# EasyEDA Pro project RCkid.epro, board Cartridge V1
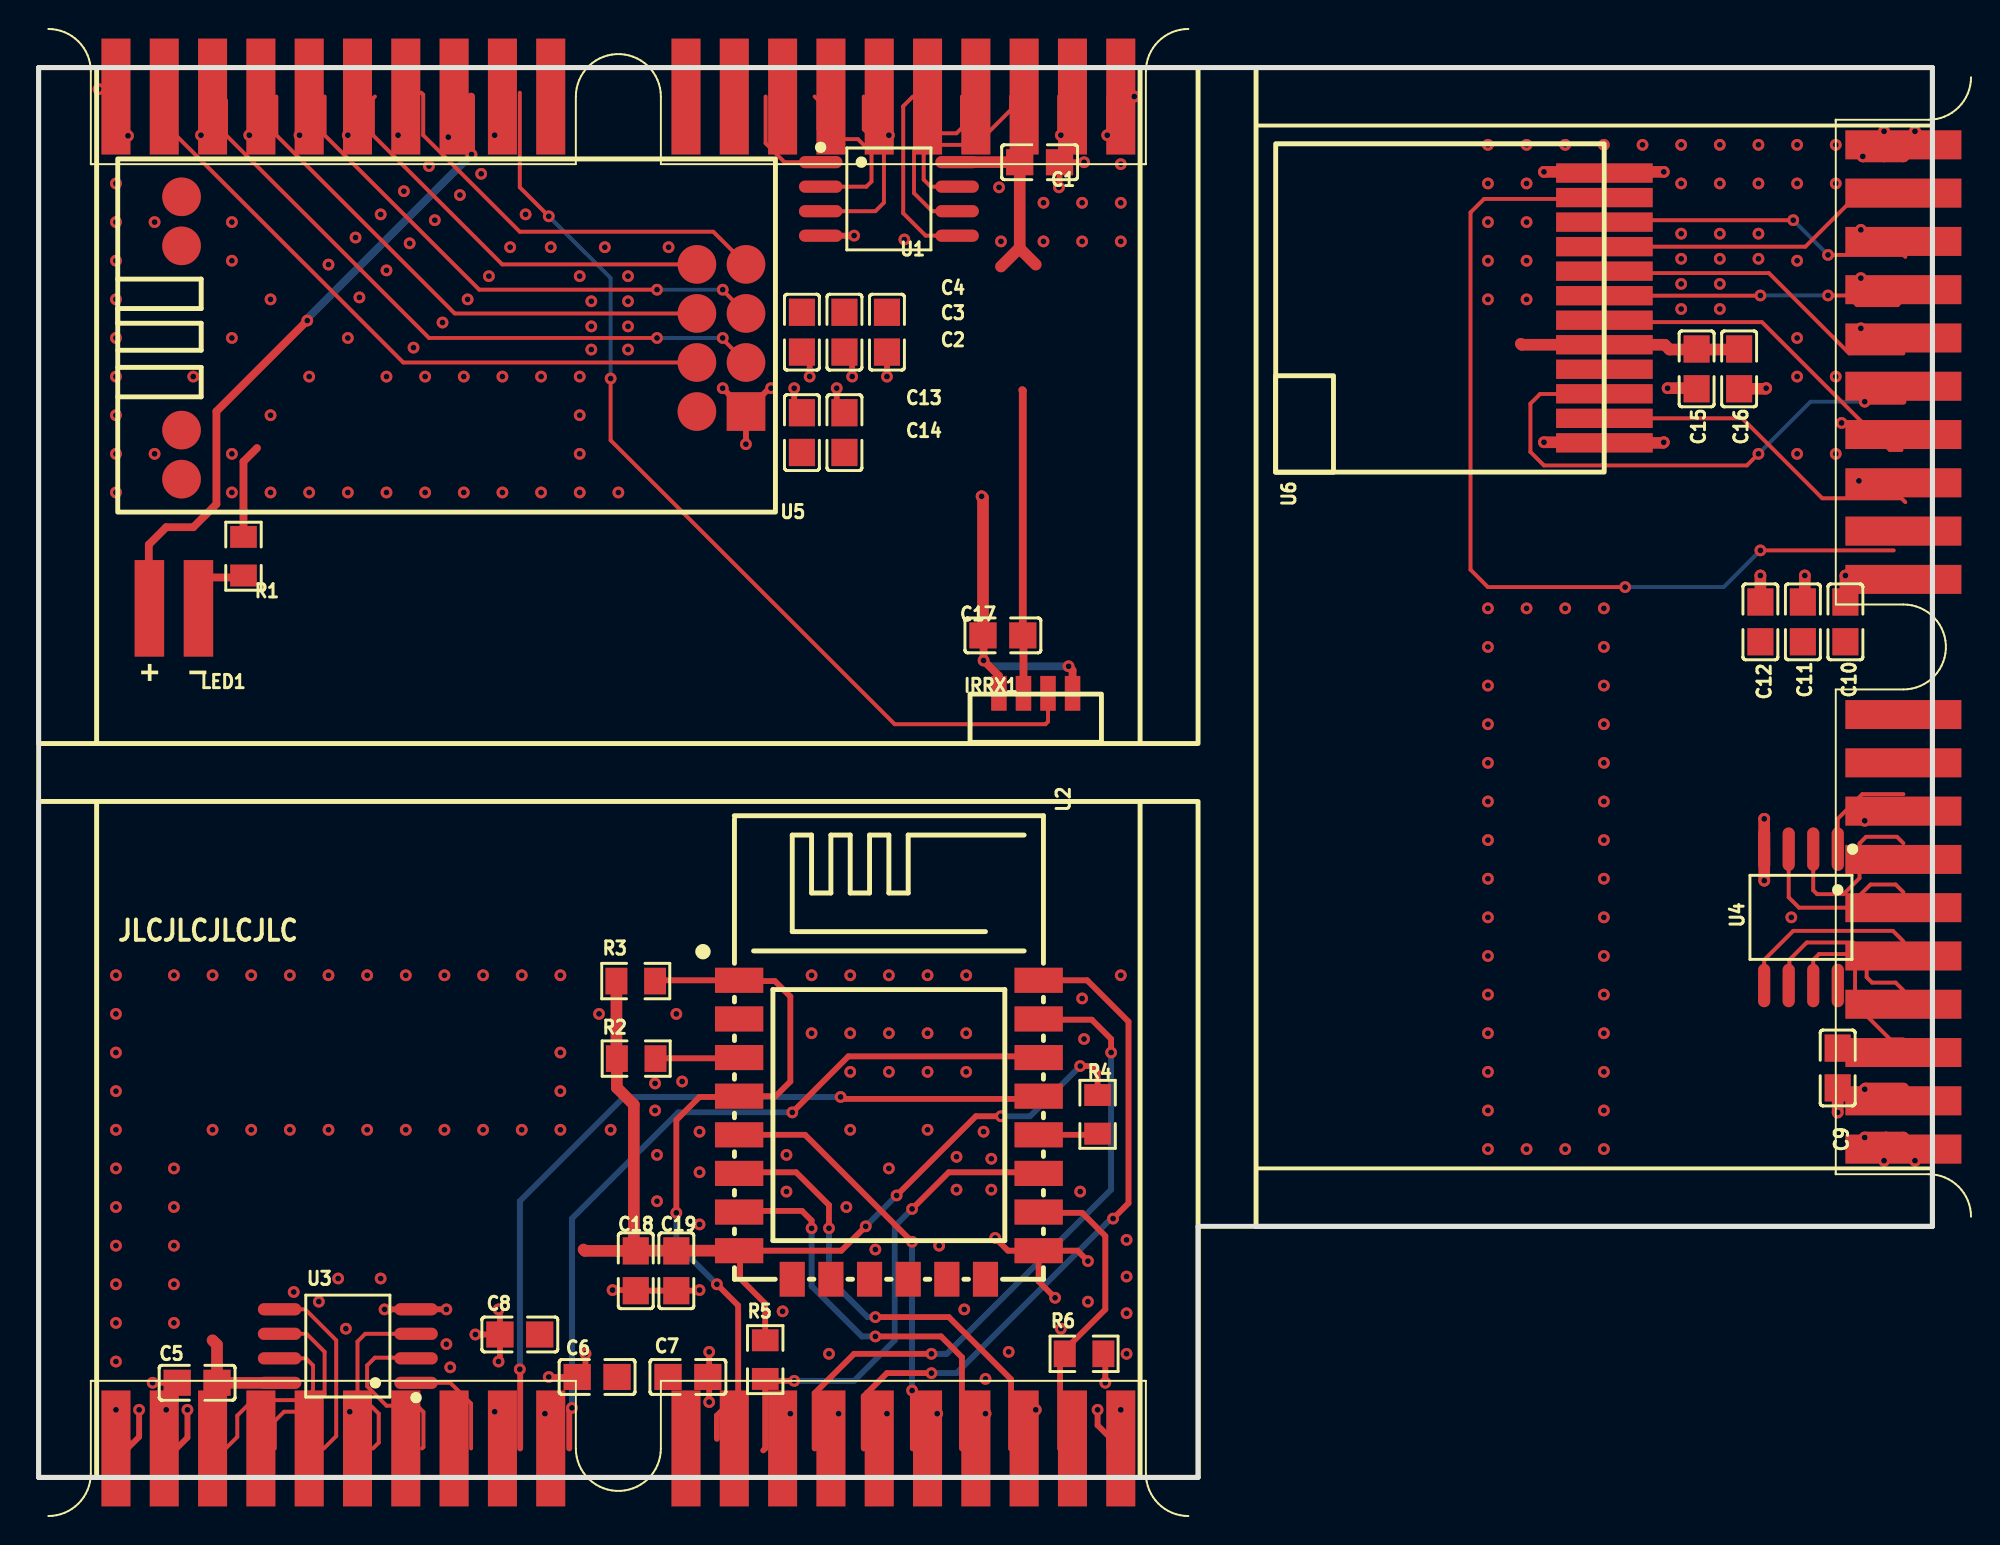
[diagram p22: board, top side]
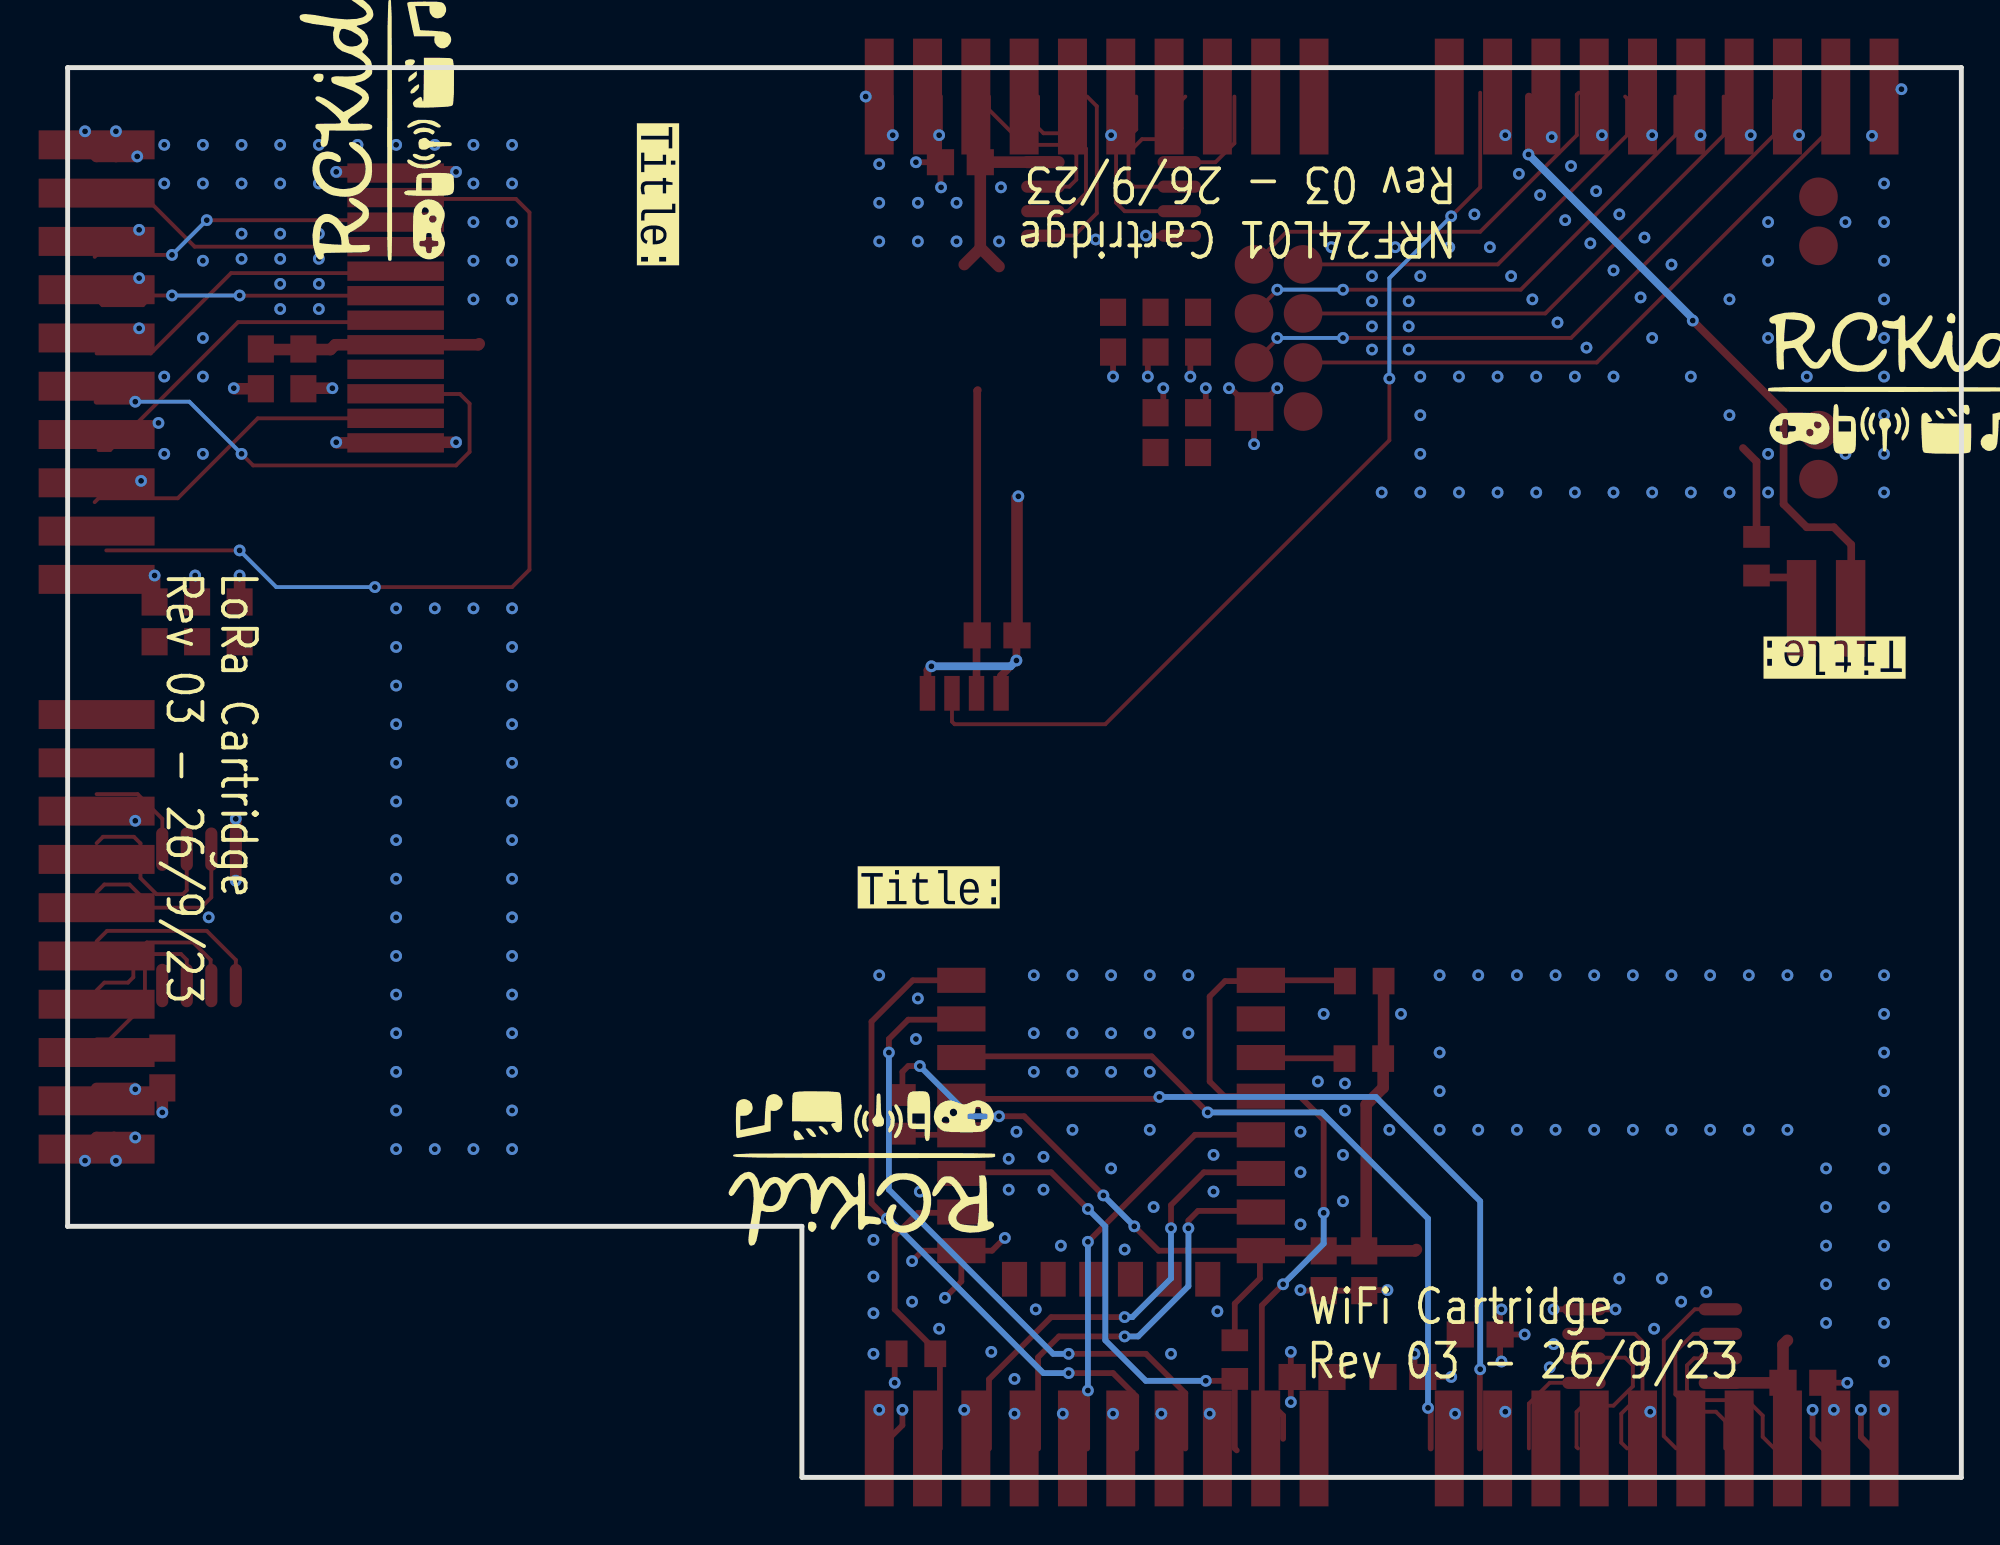
[diagram p23: board, bottom side, seen from below]

Outline 98 x 73 mm; copper layers: Top Layer, Bottom Layer. Coordinates in mm from the lower left corner of the outline.
Outline path: 0,73 98,73 98,13 60,13 60,0 0,0 0,73
Stack: Top Layer 0.035mm / Dielectric1 1.51mm FR4 er 4.5 / Bottom Layer 0.035mm

## Design rules (mm)
template: JLCPCB Capability(Two Layers Board)
spacing copperThickness1oz (default): track to track 0.102, other pairs 0.152 to 0.3
spacing copperThickness2oz: track to track 0.203, other pairs 0.152 to 0.3
track width copperThickness1oz (default): min 0.127, default 0.254, max 2.54
track width copperThickness2oz: min 0.203, default 0.254, max 2.54
differential pair differentialPair (default): width min 0.127, default 0.254, max 2.54; gap min 0.152, default 0.152
via viaSize (default): diameter min 0.5, default 0.61, max 10; hole min 0.3, default 0.305, max 6.3

## Placement (name value [footprint] x y rotation side)
C1  100nF  [C0805]  51.8 68.1 180 top
C2  47uF  [C0805]  43.9 59.3 270 top
C3  47uF  [C0805]  41.7 59.3 270 top
C4  47uF  [C0805]  39.5 59.3 270 top
C5  100nF  [C0805]  8.2 4.9 0 top
C6  47uF  [C0805]  33.6 5.2 0 top
C7  47uF  [C0805]  28.9 5.2 180 top
C8  47uF  [C0805]  24.9 7.4 180 top
C9  100nF  [C0805]  93.1 21.2 90 top
C10  47uF  [C0805]  93.5 44.3 90 top
C11  47uF  [C0805]  91.3 44.3 90 top
C12  47uF  [C0805]  89.1 44.3 90 top
C13  100nF  [C0805]  39.5 54.1 270 top
C14  10uF  [C0805]  41.7 54.1 270 top
C15  100nF  [C0805]  85.8 57.4 90 top
C16  10uF  [C0805]  88 57.4 90 top
C17  100nF  [C0805]  49.9 43.6 0 top
C18  100nF  [C0805]  30.9 10.7 90 top
C19  10uF  [C0805]  33 10.7 90 top
CONN1  -  [RCKid Cartridge Pins]  30 71.5 0 top
CONN2  -  [RCKid Cartridge Pins]  30 1.5 180 top
CONN3  -  [RCKid Cartridge Pins]  96.5 43 270 top
IRRX1  -  [TSSP95038TR]  51.6 40.6 180 top
LED1  -  [LED-TH_BD3.0-P2.54-FD]  7 45 0 top
R1  10K  [R0805]  10.6 47.7 90 top
R2  10K  [R0805]  30.92 21.69 180 top
R3  10K  [R0805]  30.9 25.7 180 top
R4  10K  [R0805]  54.8 18.8 90 top
R5  10K  [R0805]  37.6 6.1 90 top
R6  10K  [R0805]  54.1 6.4 180 top
U1  W25Q128JVSIQTR -YJLTY  [SOIC-8_L5.3-W5.3-P1.27-LS8.0-BL]  44 66.2 270 top
U2  ESP-12E  [WIFIM-SMD_ESP-12E-BR]  44 18 270 top
U3  W25Q128JVSIQTR -YJLTY  [SOIC-8_L5.3-W5.3-P1.27-LS8.0-BL]  16 6.8 90 top
U4  W25Q128JVSIQTR -YJLTY  [SOIC-8_L5.3-W5.3-P1.27-LS8.0-BL]  91.2 29 180 top
U5  E01-ML01DP5  [WIRELM-TH_E01-ML01DP5]  22 59 0 top
U6  -  [XL1278-SMT]  72.52 60.55 0 top

## Footprints (pads in the part's own frame, mm; a bottom-side part is the same pattern mirrored in y, then rotated)
C0805
  rect 1.41x1.35 smd: 1(-1.03,0) 2(1.03,0)
LED-TH_BD3.0-P2.54-FD
  rect 1.524x5 smd: 1(-1.27,0) 2(1.27,0)
R0805
  rect 1.133x1.377 smd: 1(-1,0) 2(1,0)
RCKid Cartridge Pins
  rect 1.5x6 smd: 1(-26,0) 2(-23.5,0) 3(-21,0) 4(-18.5,0) 5(-16,0) 6(-13.5,0) 7(-11,0) 8(-8.5,0) 9(-6,0) 10(-3.5,0) 11(3.5,0) 12(6,0) 13(8.5,0) 14(11,0) 15(13.5,0) 16(16,0) 17(18.5,0) 18(21,0) 19(23.5,0) 20(26,0)
SOIC-8_L5.3-W5.3-P1.27-LS8.0-BL
  oval 0.63x2.25 smd: 1(-1.905,-3.53) 2(-0.635,-3.53) 3(0.635,-3.53) 4(1.905,-3.53) 5(1.905,3.53) 6(0.635,3.53) 7(-0.635,3.53) 8(-1.905,3.53)
TSSP95038TR
  rect 0.8x1.8 smd: 1(-1.905,0) 2(-0.635,0) 3(0.635,0) 4(1.905,0)
WIFIM-SMD_ESP-12E-BR
  rect 1.3x2.5 smd: 1(-7.74,-7.75) 2(-5.74,-7.75) 3(-3.74,-7.75) 4(-1.74,-7.75) 5(0.26,-7.75) 6(2.26,-7.75) 7(4.26,-7.75) 8(6.26,-7.75) 15(6.26,7.75) 16(4.26,7.75) 17(2.26,7.75) 18(0.26,7.75) 19(-1.74,7.75) 20(-3.74,7.75) 21(-5.74,7.75) 22(-7.74,7.75)
  rect 1.8x1.3 smd: 9(7.74,-5.001) 10(7.739,-3.001) 11(7.739,-1.001) 12(7.739,0.999) 13(7.739,2.999) 14(7.74,4.999)
WIRELM-TH_E01-ML01DP5
  rect 2x2 smd: 1(14.605,-3.81)
  round 2 smd: 2(12.065,-3.81) 3(14.605,-1.27) 4(12.065,-1.27) 5(14.605,1.27) 6(12.065,1.27) 7(14.605,3.81) 8(12.065,3.81) 9(-14.605,-7.31) 10(-14.605,-4.77) 11(-14.605,4.77) 12(-14.605,7.31)
XL1278-SMT
  rect 5x1 smd: 1(8.509,6.985) 2(8.509,5.715) 3(8.509,4.445) 4(8.509,3.175) 5(8.509,1.905) 6(8.509,0.635) 7(8.509,-0.635) 8(8.509,-1.905) 9(8.509,-3.175) 10(8.509,-4.445) 11(8.509,-5.715) 12(8.509,-6.985)

## Nets
As in the schematic.

Pads without a net: CONN1 12 13; CONN3 12 13; U2 2 9 10 11 12 13 14; U5 9 10 11 12; U6 9

## Via types
v1: diameter 0.61, hole 0.305, Top Layer to Bottom Layer, 371 vias

## Routing (per net, layer and track width the routed paths; a pad name or vN(x,y) marks a point on that pad's centre or on a via; arc(x,y) is an arc through that point)
3V3: length 94.2
  Top Layer w0.3: v1(42.8,13) 41.54,11.74 U2.8 36.3,11.69 36.3,10.3 37.6,9 37.6,7.2 ; v1(44.4,14.6) 48.5,18.7 v1(49.8,18.7) ; v1(53.9,21.3) 54.5,21.3 54.8,21 54.8,19.9 54.7,19.8
  Top Layer w0.4: C17.2 50.93,56.27 50.9,56.3 ; IRRX1.3 50.97,43.44 50.9,43.5
  Top Layer w0.6: 76.7,58.7 76.75,58.65 U6.8 84.15,58.65 84.4,58.4 85.7,58.4 85.8,58.5 ; 29.92,21.68 29.9,21.7 R3.2 ; 29.92,21.68 30,21.6 ; 29.92,21.68 R2.2 ; 29.92,21.68 29.92,20.18 30.8,19.3 30.8,11.9 30.9,11.8 ; U3.8 9.31,4.9 9.3,4.9 ; 9,7.1 9.23,6.87 C5.2 ; C18.2 28.27,11.73 28.2,11.8 ; C16.2 87.97,58.4 85.9,58.4 ; 50.8,68.1 50.79,68.11 U1.8 ; 50.77,63.67 49.8,62.7 ; 50.77,63.67 C1.2 ; 50.77,63.67 50.77,63.63 51.6,62.8 ; 32.96,11.74 32.9,11.8 ; 32.96,11.74 U2.8 ; 32.96,11.74 31.1,11.74 ; C19.2 32.97,11.7
  Bottom Layer w0.3: v1(42.8,13) v1(44.4,14.6) ; v1(53.9,21.3) 51.3,18.7 v1(49.8,18.7)
GND: length 118.8
  Top Layer w0.3: U2.15 53.76,11.74 v1(54.3,11.2) ; U2.15 50.16,11.74 v1(49.5,12.4) ; U2.15 51.75,10.15 v1(52.6,9.3) ; v1(52.8,66.8) 52.83,66.83 C1.1 v1(54.1,68.1) ; C5.1 v1(5.9,4.9) ; v1(52.9,69.5) 52.86,69.54 52.86,71.5 ; v1(56,3.5) 56,2.7 55.4,2.1 ; 55.4,2.1 55.4,1.5 ; 55.4,2.1 54.8,2.7 v1(54.8,3.5) ; v1(39.9,57) 39.9,57.77 39.5,58.17 ; U5.1 37.81,56.4 v1(37.9,56.4) ; U5.1 36.6,55.19 v1(35.4,56.4) ; U5.1 36.6,53.5 v1(36.6,53.5) ; v1(21.1,8.7) 21.09,8.71 U3.4 19.53,8.7 v1(17.9,8.7) ; U1.4 42.19,64.3 v1(42.2,64.3) ; C14.1 41.3,55.53 v1(41.3,56.4) ; C8.2 23.87,6.07 v1(23.8,6) ; C8.2 23.87,8.63 v1(23.8,8.7) ; C8.2 v1(22.6,7.4) ; C13.1 39.1,55.53 v1(39.1,56.4) ; v1(7.7,3.5) 7.7,2.06 7.14,1.5 6.6,2.04 v1(6.6,3.5) ; v1(55.2,4.9) 55.2,6.3 R6.1 ; v1(5.2,3.5) 5.2,2.1 4.6,1.5 4.6,1.9 4,2.5 v1(4,3.5) ; 31,9.7 31.03,9.67 C19.1 34.17,9.67 v1(34.2,9.7) ; C3.2 42.1,57.87 v1(42.1,57) ; v1(29.7,9.7) 30.87,9.7 C18.1 ; C2.2 v1(43.9,57) ; 55.4,71.5 55.4,69.6 v1(55.3,69.5) ; v1(26.4,5.2) C7.2 28.3,5.63 v1(28.3,6.4) ; v1(34.7,3.9) 34.7,5.13 C6.2 34.7,5.27 v1(34.7,6.5)
  Top Layer w0.4: 48.8,43.9 48.9,43.8 ; 11.3,53.3 10.6,52.6 R1.2 ; IRRX1.4 49.69,41.5 v1(48.9,42.3) 48.9,43.6 48.8,43.7 ; IRRX1.1 53.5,41.8 v1(53.3,42)
  Top Layer w0.6: 95.6,17.6 95.5,17.5 v1(95.5,16.4) ; 95.6,17.6 v1(94.5,17.6) ; 95.6,17.6 96.5,17.6 97.1,17 v1(97.1,16.4) ; v1(97.1,69.7) 97.1,69 96.5,68.4 95.5,68.4 ; C17.1 48.87,50.73 v1(48.8,50.8) ; v1(77.9,53.6) 81,53.6 U6.12 84.07,53.57 v1(84.1,53.6) ; 96.5,20.14 94.54,20.14 v1(94.5,20.1) ; v1(89.3,34.1) 89.29,34.09 U4.4 89.3,32.53 v1(89.3,30.9) ; v1(93.5,46.7) C10.2 ; C15.1 85.77,56.4 v1(84.3,56.4) ; v1(91.4,46.7) 91.4,45.43 C11.2 ; C12.2 v1(89.1,46.7) ; 95.5,68.4 v1(95.5,69.7) ; 95.5,68.4 v1(94.4,68.4) ; v1(84.1,67.6) 82.7,67.6 82.64,67.54 U6.1 80.97,67.6 v1(77.9,67.6) ; C9.1 v1(93.1,18.9) ; C16.1 89.37,56.37 v1(89.4,56.4)
  Bottom Layer w0.4: v1(53.3,42) 49.2,42 v1(48.9,42.3)
  vias: v1(3.1,71.88) v1(4,67) v1(4,65) v1(4,63) v1(4,61) v1(4,59) v1(4,57) v1(4,55) v1(4,53) v1(4,51) v1(4,26) v1(4,24) v1(4,22) v1(4,20) v1(4,18) v1(4,16) v1(4,14) v1(4,12) v1(4,10) v1(4,8) v1(4,6) v1(4.62,69.47) v1(6,65) v1(6,53) v1(7,26) v1(7,16) v1(7,14) v1(7,12) v1(7,10) v1(7,8) v1(8,57) v1(8.4,69.5) v1(9,26) v1(9,18) v1(10,65) v1(10,63) v1(10,59) v1(10,53) v1(10,51) v1(10.9,69.5) v1(11,26) v1(11,18) v1(12,61) v1(12,55) v1(12,51) v1(13,26) v1(13,18) v1(13.2,9.6) v1(13.5,69.5) v1(14,57) v1(14,51) v1(14.5,9.1) v1(15,62.8) v1(15,26) v1(15,18) v1(15.5,10.3) v1(15.9,7.7) v1(16,69.5) v1(16,59) v1(16,51) v1(16.1,3.4) v1(16.4,64.2) v1(16.6,61.1) v1(17,26) v1(17,18) v1(17.7,65.4) v1(17.7,10.3) v1(18,62.5) v1(18,57) v1(18,51) v1(18.6,69.5) v1(18.9,66.6) v1(19,26) v1(19,18) v1(19.2,63.9) v1(19.4,58.5) v1(20,57) v1(20,51) v1(20.2,67.9) v1(20.5,65.1) v1(20.9,59.8) v1(21,26) v1(21,18) v1(21.1,6.9) v1(21.2,69.4) v1(21.3,5.7) v1(21.8,66.4) v1(22,57) v1(22,51) v1(22.2,61) v1(22.9,67.5) v1(23,26) v1(23,18) v1(23.3,62.2) v1(23.6,69.5) v1(23.6,3.4) v1(24,57) v1(24,51) v1(24.4,63.7) v1(25,26) v1(25,18) v1(25.2,65.4) v1(26,57) v1(26,51) v1(26.2,3.3) v1(26.5,63.7) v1(27,26) v1(27,22) v1(27,20) v1(27,18) v1(28,62.2) v1(28,57) v1(28,55) v1(28,53) v1(28,51) v1(28.6,60.9) v1(28.6,59.6) v1(28.6,58.4) v1(29,24) v1(29.3,63.7) v1(29.6,18) v1(30,51) v1(30.5,62.2) v1(30.5,60.9) v1(30.5,59.6) v1(30.5,58.4) v1(31.9,20.4) v1(31.9,19) v1(32,16.7) v1(32,14.3) v1(32.6,63.7) v1(33,24) v1(33.3,20.5) v1(34.2,17.9) v1(34.2,15.8) v1(34.2,13.1) v1(38.5,8.6) v1(38.7,16.7) v1(38.7,14.8) v1(38.9,3.3) v1(40,26) v1(40,23) v1(40.9,6.4) v1(41.4,3.3) v1(41.8,14) v1(42,26) v1(42,23) v1(42,21) v1(42,18) v1(43.3,11.8) v1(43.9,3.3) v1(44,69.5) v1(44,26) v1(44,23) v1(44,21) v1(44,16) v1(44.8,64.1) v1(46,26) v1(46,23) v1(46,21) v1(46,18) v1(46.5,3.3) v1(46.6,12) v1(47.5,16.6) v1(47.5,14.9) v1(47.9,8.7) v1(48,26) v1(48,23) v1(48,21) v1(48.9,17.9) v1(49,5.1) v1(49,3.3) v1(49.3,16.5) v1(49.3,14.9) v1(49.7,66.8) v1(49.8,64) v1(50.2,6.5) v1(51.6,3.5) v1(52,66) v1(52,64) v1(52.9,7.7) v1(53.9,14.8) v1(54,66) v1(54,64) v1(54,24.8) v1(54.1,22.7) v1(54.3,9.1) v1(56,68) v1(56,66) v1(56,64) v1(56,26) v1(56.3,12.3) v1(56.3,10.4) v1(56.3,8.5) v1(56.3,6.4) v1(56.7,71.5) v1(75,69) v1(75,67) v1(75,65) v1(75,63) v1(75,61) v1(75,45) v1(75,43) v1(75,41) v1(75,39) v1(75,37) v1(75,35) v1(75,33) v1(75,31) v1(75,29) v1(75,27) v1(75,25) v1(75,23) v1(75,21) v1(75,19) v1(75,17) v1(77,69) v1(77,67) v1(77,65) v1(77,63) v1(77,61) v1(77,45) v1(77,17) v1(79,69) v1(79,45) v1(79,17) v1(81,69) v1(81,45) v1(81,43) v1(81,41) v1(81,39) v1(81,37) v1(81,35) v1(81,33) v1(81,31) v1(81,29) v1(81,27) v1(81,25) v1(81,23) v1(81,21) v1(81,19) v1(81,17) v1(83,69) v1(85,69) v1(85,67) v1(85,64.4) v1(85,63.1) v1(85,61.8) v1(85,60.5) v1(87,69) v1(87,67) v1(87,64.4) v1(87,63.1) v1(87,61.8) v1(87,60.5) v1(89,69) v1(89,67) v1(89,64.4) v1(89,63.1) v1(90.7,29) v1(91,69) v1(91,67) v1(91,63) v1(91,59) v1(91,57) v1(91,53) v1(93,69) v1(93,67) v1(93,57) v1(93,53) v1(93.3,54.6) v1(94.2,51.6) v1(94.3,64.6) v1(94.3,62.1) v1(94.3,59.5) v1(94.5,34)
DIO0: length 16.4
  Top Layer w0.2: U6.3 81.13,65.1 v1(90.8,65.1) ; 96.6,63.2 96.5,63.3 v1(92.6,63.3)
  Bottom Layer w0.2: v1(90.8,65.1) v1(92.6,63.3)
DIO1: length 17.4
  Top Layer w0.2: 96.6,50.5 96.4,50.7 92.3,50.7 88.16,54.84 U6.11
DIO2: length 27.5
  Top Layer w0.2: 81.03,56.11 81.02,56.1 77.7,56.1 77.2,55.6 77.2,53.1 77.9,52.4 88.4,52.4 v1(89,53)
  Top Layer w0.3: v1(94.5,55.7) 96.5,55.7
  Bottom Layer w0.2: v1(94.5,55.7) 91.7,55.7 v1(89,53)
ESP_FLASH: length 25.9
  Top Layer w0.3: v1(45.2,13.9) 47.1,15.8 51.69,15.8 U2.17 ; 37.6,5 37.5,5 ; 37.6,5 v1(39.1,5) ; 37.6,5 R5.1 ; 37.6,5 37.6,1.5 37.5,1.4
  Bottom Layer w0.3: v1(45.2,13.9) 44.3,13 44.3,7.1 42.2,5 v1(39.1,5)
ESP_RESET: length 36.4
  Top Layer w0.3: v1(33,13.7) 33,18.5 34.2,19.7 36.21,19.7 U2.4 38.14,19.74 38.9,20.5 38.9,24.9 38.1,25.7 36.6,25.7 36.5,25.6 ; 35.1,2 35.1,3.2 36.2,4.3 36.2,8.9 v1(35.1,10) ; 32,25.7 32.04,25.74 U2.1
  Bottom Layer w0.3: v1(35.1,10) 33,12.1 v1(33,13.7)
ESP_RXD: length 34.6
  Top Layer w0.3: 51.7,23.6 51.8,23.7 54.5,23.7 55.5,22.7 v1(55.5,22) ; v1(46.2,6.4) 42.2,6.4 40.16,4.36 40.16,1.5
  Bottom Layer w0.3: v1(55.5,22) 55.5,14.9 47,6.4 v1(46.2,6.4)
ESP_TXD: length 35.5
  Top Layer w0.3: U2.22 54.26,25.74 56.4,23.6 56.4,14.2 v1(55.6,13.4) ; 42.7,1.5 42.7,4.2 43.9,5.4 v1(46.2,5.4)
  Bottom Layer w0.3: v1(55.6,13.4) 55.5,13.4 47.5,5.4 v1(46.2,5.4)
I2C_SCL: length 39.6
  Top Layer w0.3: v1(39,18.9) 41.9,21.8 51.69,21.8 U2.20 ; v1(27.6,3.6) 27.46,3.46 27.46,1.5
  Bottom Layer w0.3: v1(39,18.9) 33.1,18.9 27.6,13.4 v1(27.6,3.6)
I2C_SDA: length 41.9
  Top Layer w0.3: v1(24.9,5.6) 24.92,5.58 24.92,1.5 ; v1(41.5,19.7) 41.6,19.6 51.7,19.6
  Bottom Layer w0.3: v1(24.9,5.6) 24.9,14.3 30.3,19.7 v1(41.5,19.7)
IR_RX: length 50.2
  Top Layer w0.2: 24.9,71.7 24.9,66.8 v1(26.4,65.3) ; 52.24,40.6 52.24,39.14 52.1,39 44.3,39 29.6,53.7 v1(29.6,56.9)
  Bottom Layer w0.2: v1(29.6,56.9) 29.6,62.1 v1(26.4,65.3)
IR_TX: length 33.1
  Top Layer w0.4: v1(13.9,59.9) 9.2,55.2 9.2,50.4 8,49.2 6.6,49.2 5.7,48.3 5.7,46.1 ; v1(22.4,68.5) 22.38,68.52 22.38,71.5
  Bottom Layer w0.4: v1(22.4,68.5) 13.9,60 v1(13.9,59.9)
LORA_RESET: length 48.8
  Top Layer w0.2: v1(89.1,48) 96,48 ; v1(82.1,46.1) 75,46.1 74.1,47 74.1,65.5 74.8,66.2 80.96,66.2 U6.2
  Bottom Layer w0.2: v1(89.1,48) 87.2,46.1 v1(82.1,46.1)
NRF_IRQ: length 21.6
  Top Layer w0.2: U5.8 23.99,62.81 17.3,69.5 17.3,71.4 17.4,71.5
NRF_RXTX: length 33.6
  Top Layer w0.2: U5.3 35.4,58.94 v1(35.4,59) ; 9.7,71.3 9.7,69.5 20.2,59 v1(32,59)
  Bottom Layer w0.2: v1(35.4,59) v1(32,59)
QSPI_SCLK: length 28.2
  Top Layer w0.2: U4.6 90.6,25.5 90.6,26.8 91.5,27.7 93.9,27.7 94.6,27 94.6,25.9 94.88,25.62 96.1,25.62 96.5,25.22 ; U1.6 46.24,65.56 45.3,66.5 45.3,68.8 46.1,69.6 47.5,69.6 47.78,69.88 47.78,71.5 ; U3.6 13.86,7.44 14.8,6.5 14.8,4.3 13.9,3.4 12.7,3.4 12.22,2.92 12.22,1.5
QSPI_SD0: length 28.4
  Top Layer w0.2: 14.76,1.5 15.4,2.14 15.4,7.1 13.8,8.71 U3.5 ; U1.5 47.53,64.3 45.9,64.3 44.74,65.46 44.74,71 45.24,71.5 ; 96.5,27.76 95.96,28.3 90.8,28.3 89.29,26.8 U4.5
QSPI_SD1: length 27.7
  Top Layer w0.2: 96.5,32.84 96.17,33.17 94.57,33.17 94.23,32.83 94.23,31.03 93.4,30.2 92.03,30.2 91.84,30.4 91.84,32.53 ; 19.84,1.5 19.91,1.57 19.91,3.39 19.59,3.71 18,3.71 17,4.72 17,5.8 17.4,6.2 19.5,6.2 19.53,6.16 ; 40.16,71.5 40.36,71.3 40.36,69.84 40.91,69.3 42.4,69.3 43.1,68.59 43.1,67.1 42.84,66.83 U1.2
QSPI_SD2: length 28
  Top Layer w0.2: 96.5,30.3 96.1,30.7 94.8,30.7 93.6,29.5 91.1,29.5 90.56,30.03 U4.3 ; 17.3,1.5 17.6,1.8 17.6,3.3 16.5,4.4 16.5,7.03 16.9,7.44 U3.3 ; U1.3 43.3,65.56 43.74,66.01 43.74,68.76 42.7,69.8 42.7,71.5
QSPI_SD3: length 28.2
  Top Layer w0.2: 50.32,71.5 50.32,70.82 48.5,69 46.3,69 45.8,68.5 45.8,67.2 46.16,66.83 U1.7 ; 96.5,22.68 95.82,22.68 94,24.5 94,26.7 93.6,27.1 92.13,27.1 91.84,26.8 91.84,25.47 ; 12.47,6.16 13.83,6.16 14.2,5.8 14.2,4.51 13.69,4 11.08,4 10.28,3.2 10.28,2.1 9.68,1.5
QSPI_SS: length 16.8
  Top Layer w0.2: 37.62,71.5 37.62,69.08 38.6,68.1 40.47,68.1 U1.1 ; 96.5,35.38 94.38,35.38 93.1,34.1 93.1,32.53 U4.1 ; 22.38,1.5 22.38,3.82 21.3,4.9 19.53,4.9 U3.1
SPI_CE: length 50.7
  Top Layer w0.2: 7.1,71.9 7.1,69.5 18.87,57.73 U5.4 ; 96.6,65.9 93.6,65.9 91.43,63.73 U6.4
SPI_CS: length 15.7
  Top Layer w0.3: 52.86,1.5 52.86,6.36 55.2,8.7 55.2,12.5 54,13.7 52,13.7
SPI_MISO: length 63.8
  Top Layer w0.2: U6.7 81.13,59.82 89.18,59.82 95.8,53.2 96.4,53.2 ; 19.8,71.7 19.9,71.6 19.9,69.5 24.9,64.5 34.91,64.5 U5.7
  Top Layer w0.3: 36.6,15.8 39.2,15.8 40.9,14.1 v1(40.9,12.9) ; 50.32,1.5 50.32,5.08 47.1,8.3 v1(43.3,8.3)
  Bottom Layer w0.3: v1(40.9,12.9) 40.9,10.3 42.9,8.3 v1(43.3,8.3)
SPI_MOSI: length 64.2
  Top Layer w0.2: 96.3,60.8 96.2,60.7 94.1,60.7 93.6,61.2 v1(92.6,61.2) ; U6.6 89.09,61.19 v1(89.1,61.2) ; 12.3,71.5 12.3,69.5 21.53,60.27 U5.6
  Top Layer w0.3: v1(43.3,7.3) 46.7,7.3 47.78,6.22 47.78,1.5 ; 36.5,13.8 39.5,13.8 40,13.3 v1(40,12.9)
  Bottom Layer w0.2: v1(89.1,61.2) v1(92.6,61.2)
  Bottom Layer w0.3: v1(43.3,7.3) 42.6,7.3 40,9.9 v1(40,12.9)
SPI_SCK: length 44.9
  Top Layer w0.2: 14.8,71.5 14.8,69.5 22.8,61.5 v1(32,61.5) ; U6.5 81.13,62.36 89.54,62.36 93.7,58.2 96.5,58.2 ; v1(35.4,61.5) 35.4,61.47 U5.5
  Bottom Layer w0.2: v1(35.4,61.5) v1(32,61.5)
SPI_SCLK: length 22
  Top Layer w0.3: 45.24,1.5 45.24,4.46 v1(45.2,4.5) ; U2.5 39.66,17.74 v1(45.2,12.2)
  Bottom Layer w0.3: v1(45.2,4.5) v1(45.2,12.2)
$1N2752: length 2.4
  Top Layer w0.4: R1.1 10.5,46.6 8.2,46.6
$2N955: length 4.2
  Top Layer w0.3: U2.3 36.21,21.7 32.1,21.7
$2N1029: length 3.1
  Top Layer w0.3: U2.18 54.74,17.74 R4.1

## Copper pours and planes (outline as drawn; the poured copper is in the pictures)
3V3 on Top Layer: 34.5,0 34.5,8.2 33.1,9.6 32.1,9.6 32,9.7 32,12.7 31.9,12.8 30.8,12.8 30.8,16.7 9.3,16.7 7.9,15.3 7.9,4 12.5,4 12.6,3.9 12.6,10 13.6,11 18.1,11 19.6,9.5 19.6,8 24.5,8 24.5,6.1 24.9,5.8 28.1,5.8 28.1,0.1 28,0
3V3 on Top Layer: 25,73 39.4,73 39.4,64.3 39.7,64 41.2,64 41.8,63.4 57,63.4 57,50 33.3,50 29.6,53.7 29.6,57.7 37.6,57.7 37.6,61.8 34.9,64.5 27.2,64.5 25,66.7
3V3 on Top Layer: 74,60 83.6,60 83.6,54.6 88.1,54.6 92.2,50.5 95,50.5 95,48 98,48 98,16 74,16
GND on Top Layer: 74,60 74,70 98,70 98,48 95.1,48 95,48.1 95,50.5 92.2,50.5 88.1,54.6 83.6,54.6 83.6,60
GND on Top Layer: 3,73 57,73 57,50 3,50
GND on Top Layer: 74,46 82,46 82,16 74,16
GND on Top Layer: 3,27 57,27 57,0 3,0
GND on Bottom Layer: 74,16 74,70 98,70 98,16
GND on Bottom Layer: 3,73 57,73 57,50 3,50
GND on Bottom Layer: 3.2,26.8 57.2,26.8 57.2,-0.2 3.2,-0.2

## Text on the board
Bottom Silkscreen Layer: WiFi Cartridge / Rev 03 - 26/9/23 | NRF24L01 Cartridge / Rev 03 - 26/9/23 | LoRa Cartridge / Rev 03 - 26/9/23 | Title:
Top Silkscreen Layer: JLCJLCJLCJLC
